# Altium schematic sheet rev02_9.SchDoc
size 409 x 282 mm
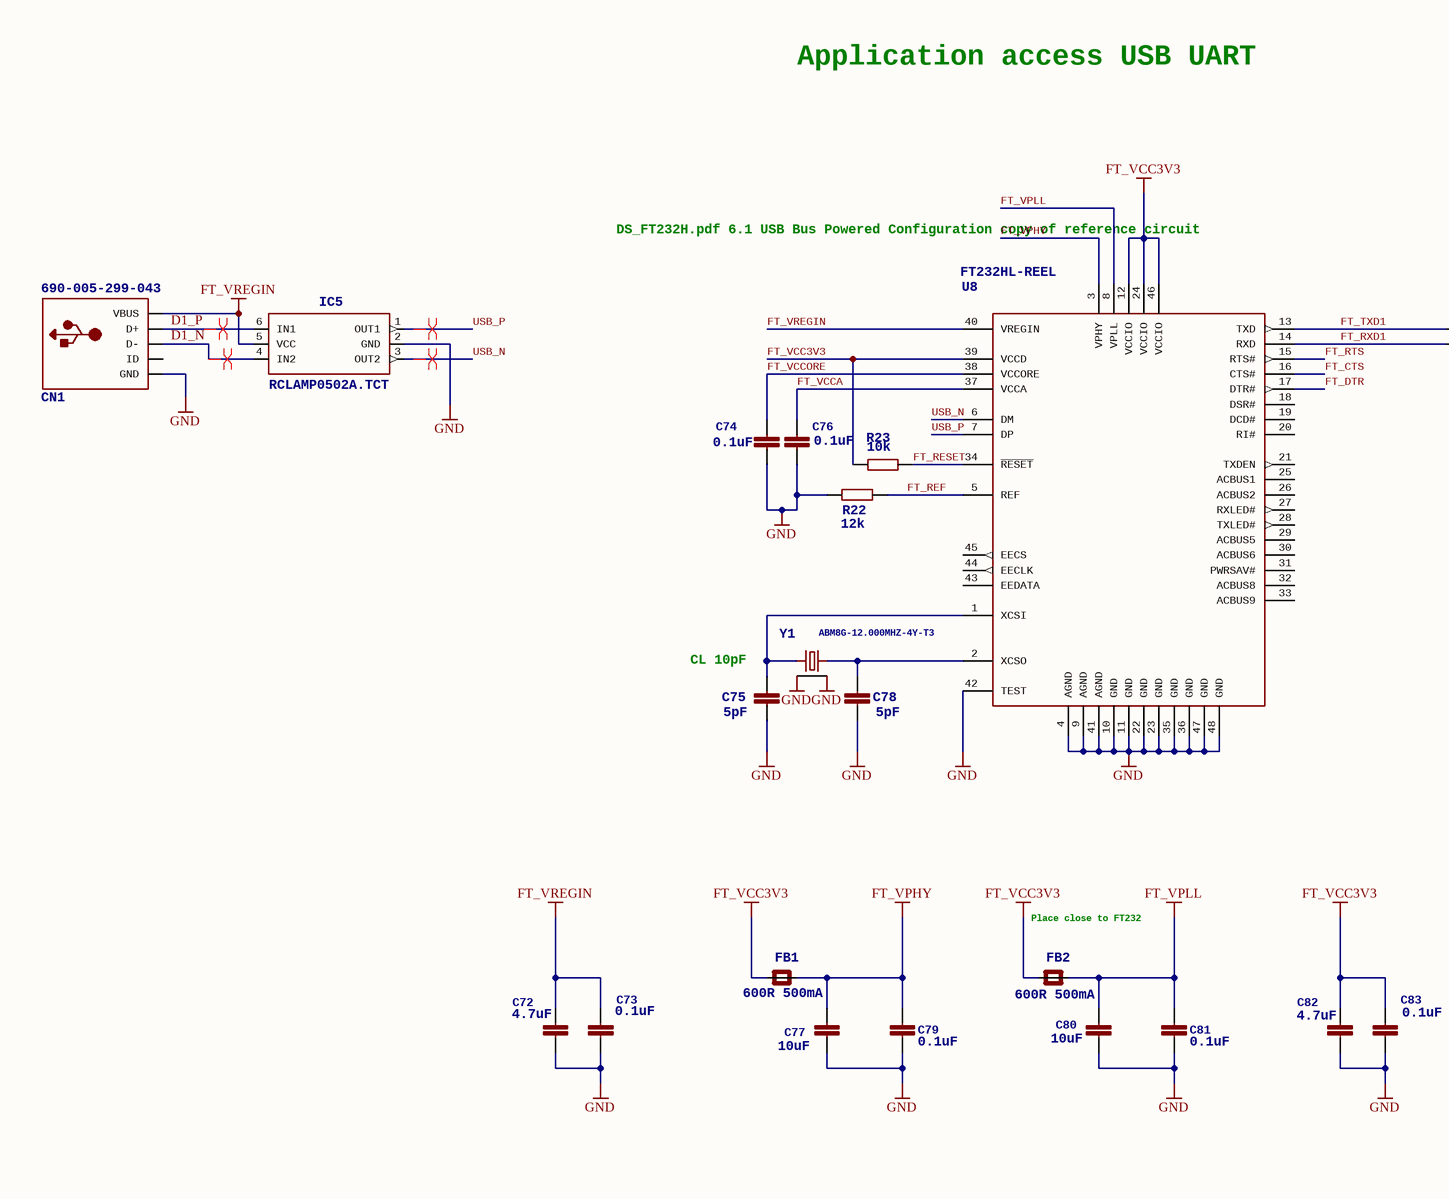
[diagram p0: rev02_9.SchDoc, left]
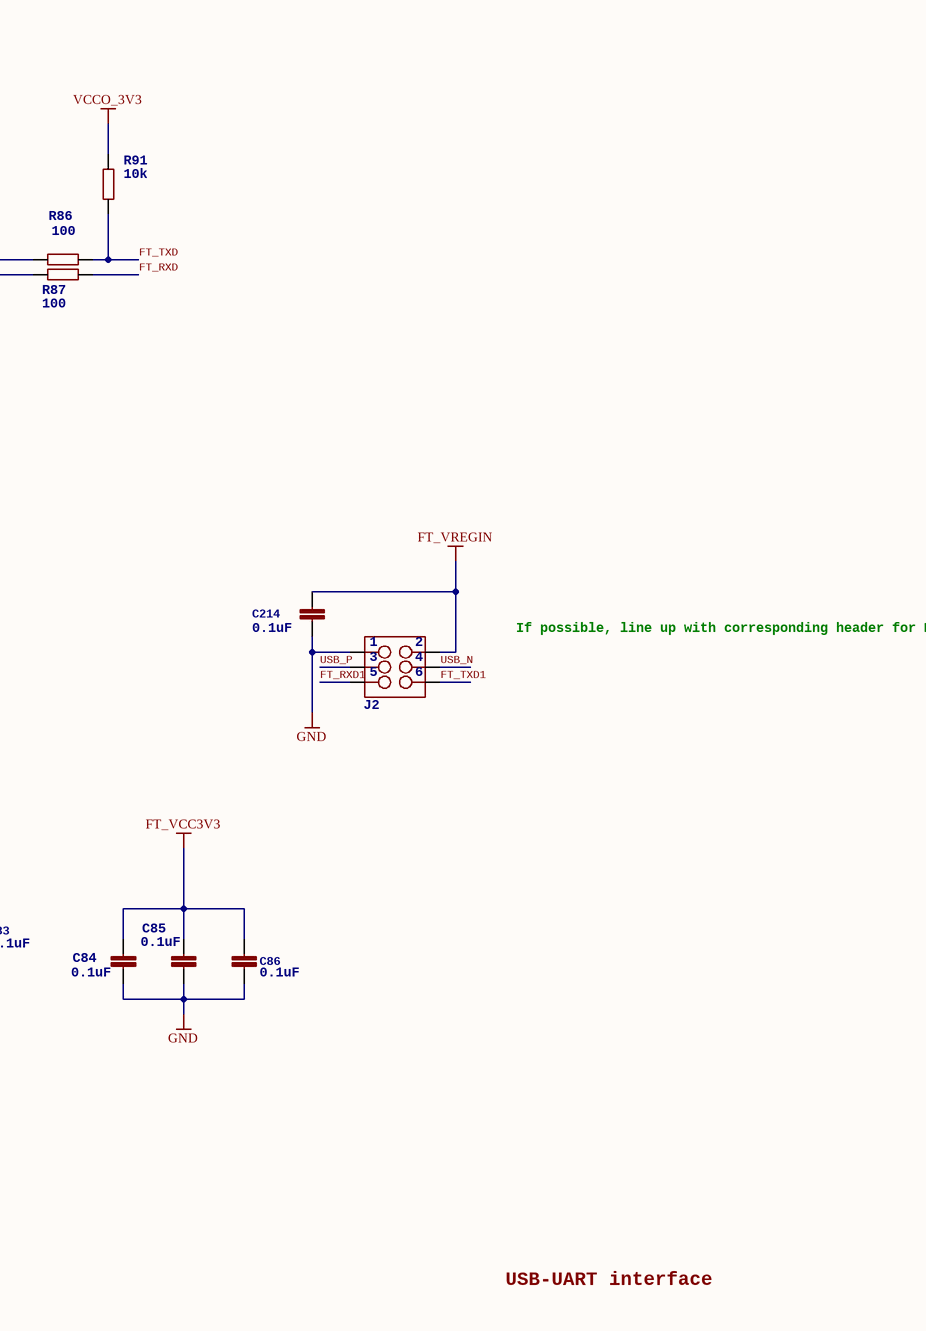
[diagram p1: rev02_9.SchDoc, right]

## Parts
C72  value 4.7uF  [C_0805]  (hidden comment: GRM21BR71A475KA73L)
C73  value 0.1uF  [C_0402]
C74  value 0.1uF  [C_0402]
C75  value 5pF  [C_0402]
C76  value 0.1uF  [C_0402]
C77  value 10uF  [C_0805]
C78  value 5pF  [C_0402]
C79  value 0.1uF  [C_0402]
C80  value 10uF  [C_0805]
C81  value 0.1uF  [C_0402]
C82  value 4.7uF  [C_0805]  (hidden comment: GRM21BR71A475KA73L)
C83  value 0.1uF  [C_0402]
C84  value 0.1uF  [C_0402]
C85  value 0.1uF  [C_0402]
C86  value 0.1uF  [C_0402]
C214  value 0.1uF  [C_0402]
CN1  690-005-299-043  [USB-MINIB]
FB1  >NAME: FB1  >VALUE: 600R 500mA  [L_0603]  (hidden comment: FBMH1608HL601-T)
FB2  >NAME: FB2  >VALUE: 600R 500mA  [L_0603]  (hidden comment: FBMH1608HL601-T)
IC5  RCLAMP0502A.TCT  >NAME: IC5  [RCLAMP0502A]
J2  M03X2NO_SILK  [PLD-6]  (value not drawn)
R22  value 12k  [R_0402]
R23  value 10k  >NAME: R23  [R_0402]
R86  value 100  [R_0402]
R87  value 100  [R_0402]
R91  value 10k  [R_0402]
U8  FT232HL-REEL  >NAME: U8  [LQFP-48]
Y1  ABM8G-12.000MHZ-4Y-T3  [CRYSTAL_3.2X2.5]

## Nets
FT_VCC3V3: C82.1 C83.1 C84.1 C85.1 C86.1 FB1.1(P$1) FB2.1(P$1) R23.2 U8.12(VCCIO) U8.24(VCCIO) U8.39(VCCD) U8.46(VCCIO)
FT_VPHY: C77.1 C79.1 FB1.2(P$2) U8.3(VPHY)
FT_VPLL: C80.1 C81.1 FB2.2(P$2) U8.8(VPLL)
FT_VREGIN: C72.1 C73.1 C214.1 CN1.VBUS IC5.5(VCC) J2.2 U8.40(VREGIN)
GND: C72.2 C73.2 C74.2 C75.1 C76.2 C77.2 C78.1 C79.2 C80.2 C81.2 C82.2 C83.2 C84.2 C85.2 C86.2 C214.2 CN1.GND IC5.2(GND) J2.1 R22.2 U8.4(AGND) U8.9(AGND) U8.10(GND) U8.11(GND) U8.22(GND) U8.23(GND) U8.35(GND) U8.36(GND) U8.41(AGND) U8.42(TEST) U8.47(GND) U8.48(GND) Y1.2 Y1.4
VCCO_3V3: R91.1
D1_N: CN1.D- IC5.4(IN2)
D1_P: CN1.D+ IC5.6(IN1)
FT_CTS: U8.16(CTS#)
FT_DTR: U8.17(DTR#)
FT_REF: R22.1 U8.5(REF)
FT_RESET: R23.1 U8.34(~{RESET})
FT_RTS: U8.15(RTS#)
FT_RXD: R87.1
FT_RXD1: J2.5 R87.2 U8.14(RXD)
FT_TXD: R86.1 R91.2
FT_TXD1: J2.6 R86.2 U8.13(TXD)
FT_VCCA: C76.1 U8.37(VCCA)
FT_VCCORE: C74.1 U8.38(VCCORE)
USB_N: IC5.3(OUT2) J2.4 U8.6(DM)
USB_P: IC5.1(OUT1) J2.3 U8.7(DP)
NetC75_2: C75.2 U8.1(XCSI) Y1.3
NetC78_2: C78.2 U8.2(XCSO) Y1.1

Not connected (* = marked no-connect by the designer): CN1 ID; U8 18(DSR#) 19(DCD#) 20(RI#) 21(TXDEN) 25(ACBUS1) 26(ACBUS2) 27(RXLED#) 28(TXLED#) 29(ACBUS5) 30(ACBUS6) 31(PWRSAV#) 32(ACBUS8) 33(ACBUS9) 43(EEDATA) 44(EECLK) 45(EECS)

## Layout directives
differential pair: D1_N, D1_P, USB_N, USB_P

## Notes on the sheet
- Application access USB UART
- DS_FT232H.pdf
  6.1 USB Bus Powered Configuration
  copy of reference circuit
- CL 10pF
- If possible, line up with
  corresponding header
  for MGMT USB-UART and
  label pins on silk screen
- (near FB2) Place close to FT232
- USB-UART interface

## Library data of the parts
C72 C82 = C-EUC0603: 0805 CAPACITOR
C73-C76 C78 C79 C81 C83-C86 C214 = C-EUC0402: 0402 CAPACITOR
C77 C80 = C-EUC0805: 0805 CAPACITOR
CN1 = USBMINIB: mini USB type B Connector
FB1 FB2 = FERRITE_0603MP: Ferrite Bead 600 Ohm 500mA
IC5 = RCLAMP0502ASC-89: USB protective diodes; MFR: SEMTECH; MPN: RCLAMP0502A; OC_FARNELL: 2058982; >VALUE: RCLAMP0502ASC-89
J2 = M03X2NO_SILK: 2x3 .1" header; 1: 1; 2: 2; 3: 3; 4: 4; 5: 5; 6: 6
R22 = R-EU_R0402: 0402 Resistor 1%
R23 R86 R87 R91 = R-EU_R0402: 0402 Resistor 5%
  R23: TOLERANCE: 5%
U8 = FT232H_SERIAL: INTERFACE, USB - UART/FIFO; OC_FARNELL: 1870924; >VALUE: FT232H_SERIAL
Y1 = CRYSTALTHIN: Crystal 12MHz